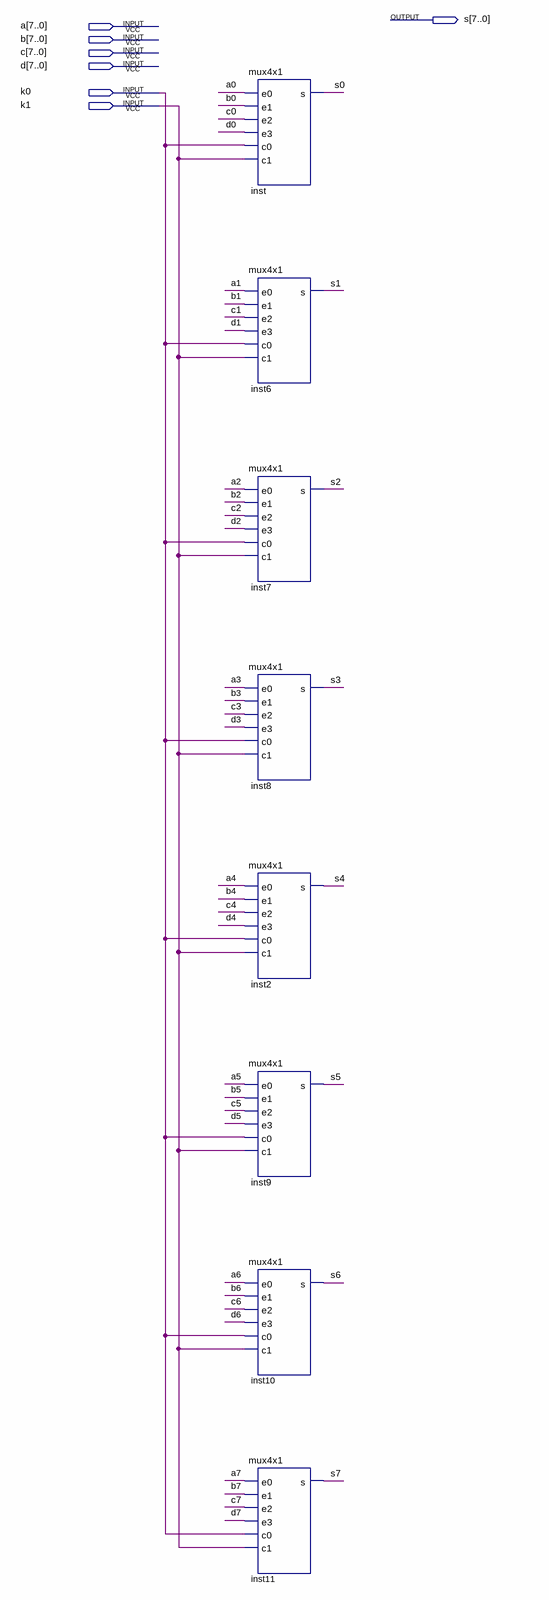
[diagram p0: schematic sheet]
// Quartus schematic mux4x1_8bits.bdf as structural Verilog: 8 symbols, 7 pins
module mux4x1_8bits (
  input  [7:0] a,
  input  [7:0] b,
  input  [7:0] c,
  input  [7:0] d,
  input  k0,
  input  k1,
  output [7:0] s
);

  mux4x1 inst (.e0(a[0]), .e1(b[0]), .e2(c[0]), .e3(d[0]), .c0(k0), .c1(k1), .s(s[0]));
  mux4x1 inst6 (.e0(a[1]), .e1(b[1]), .e2(c[1]), .e3(d[1]), .c0(k0), .c1(k1), .s(s[1]));
  mux4x1 inst7 (.e0(a[2]), .e1(b[2]), .e2(c[2]), .e3(d[2]), .c0(k0), .c1(k1), .s(s[2]));
  mux4x1 inst8 (.e0(a[3]), .e1(b[3]), .e2(c[3]), .e3(d[3]), .c0(k0), .c1(k1), .s(s[3]));
  mux4x1 inst2 (.e0(a[4]), .e1(b[4]), .e2(c[4]), .e3(d[4]), .c0(k0), .c1(k1), .s(s[4]));
  mux4x1 inst9 (.e0(a[5]), .e1(b[5]), .e2(c[5]), .e3(d[5]), .c0(k0), .c1(k1), .s(s[5]));
  mux4x1 inst10 (.e0(a[6]), .e1(b[6]), .e2(c[6]), .e3(d[6]), .c0(k0), .c1(k1), .s(s[6]));
  mux4x1 inst11 (.e0(a[7]), .e1(b[7]), .e2(c[7]), .e3(d[7]), .c0(k0), .c1(k1), .s(s[7]));
endmodule
